# EAGLE design Andonstar LED Ring (EAGLE 6.2)
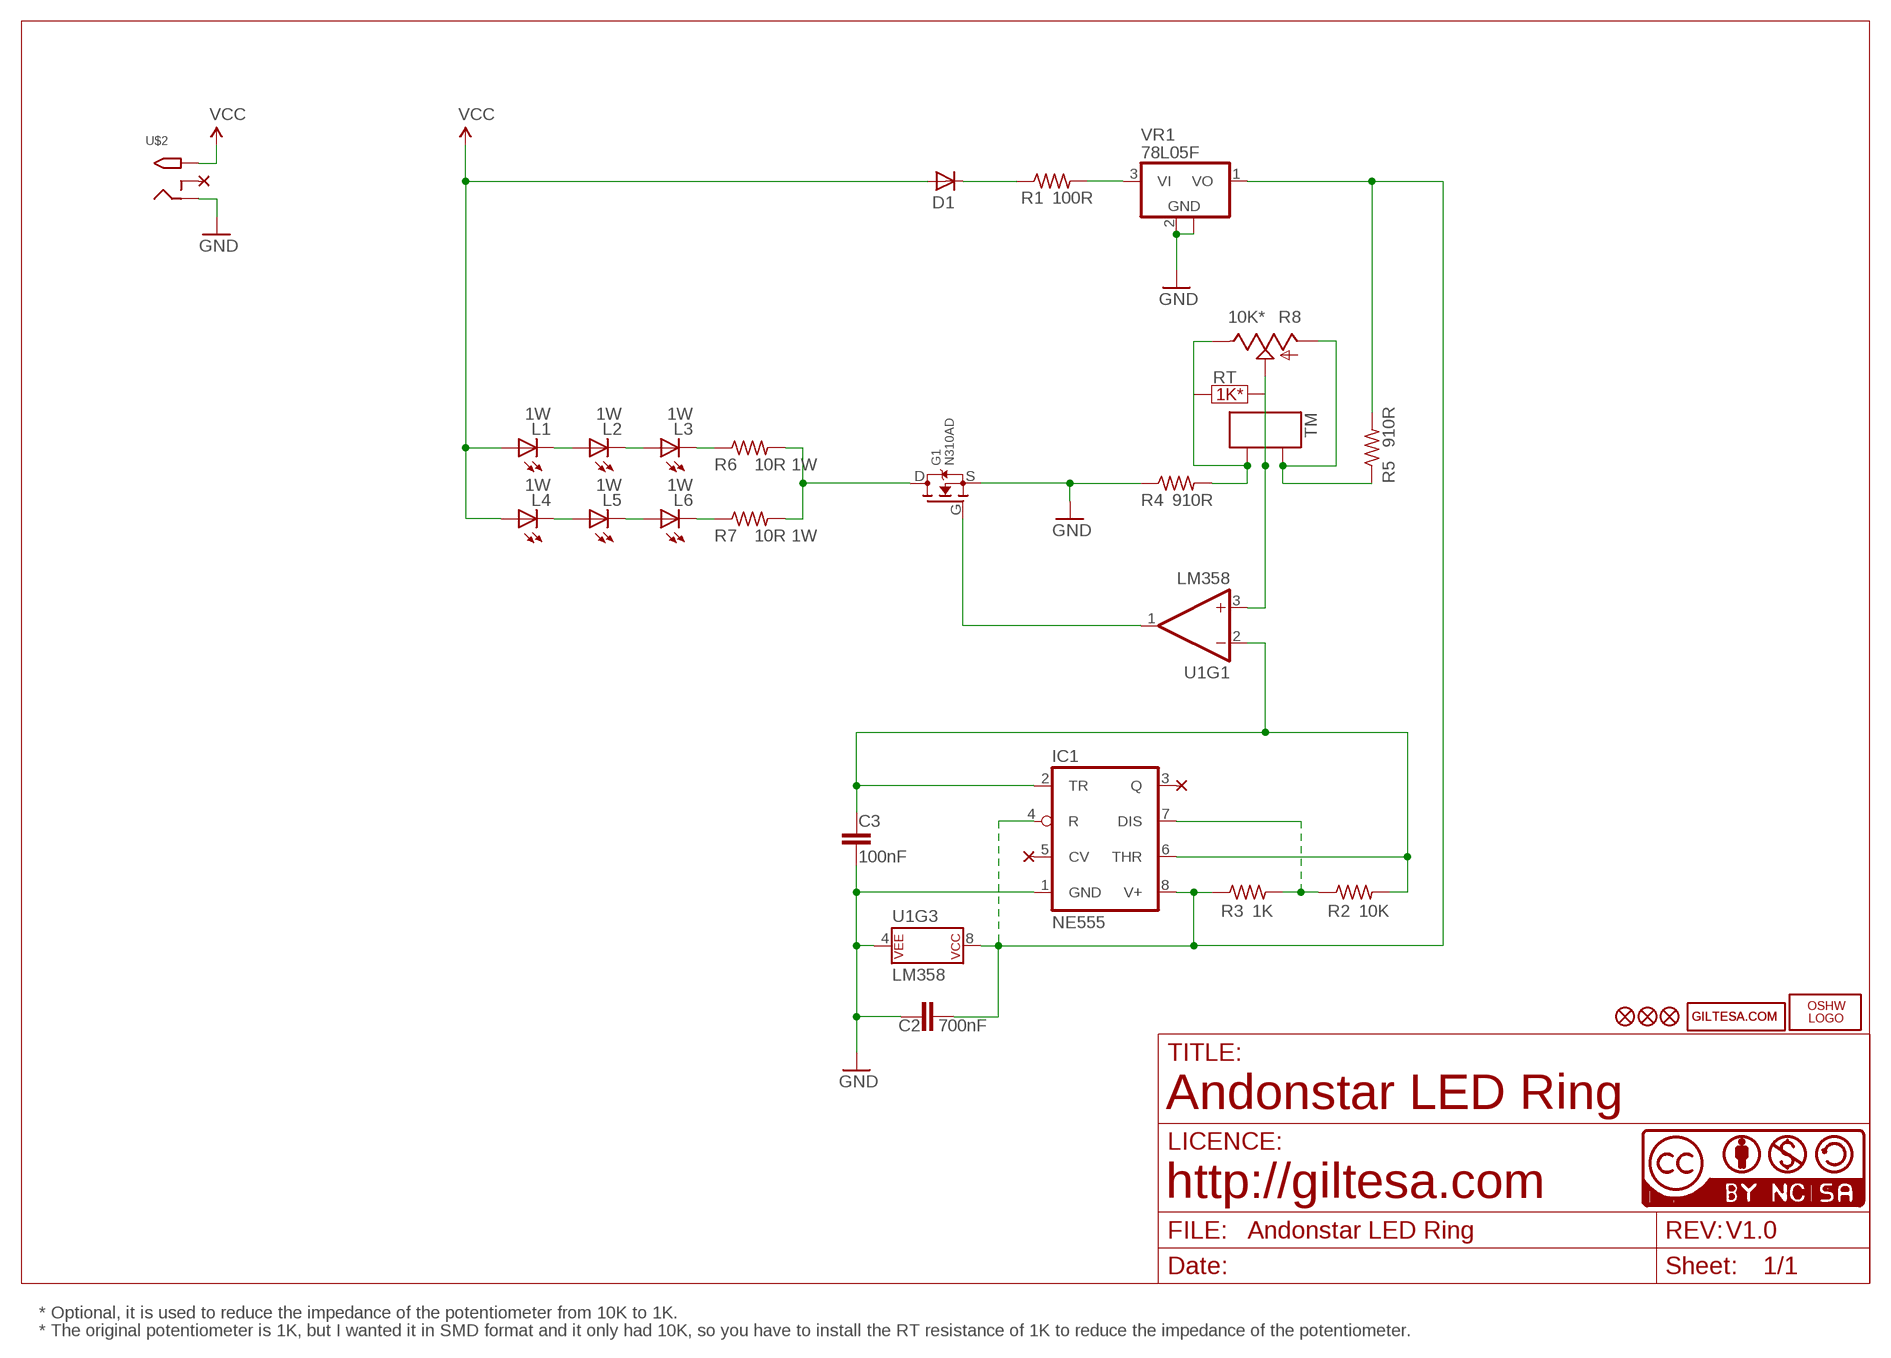
[diagram p0: schematic, sheet 1]

## Parts
C2  700nF  C0603  [C0603]
C3  100nF  C0603  [C0603]
D1  DIODE-GF1  [GF1]
G1  N310AD  FDD8447L  [TO-252]
IC1  NE555  NE555D  [SO08]
L1  1W  LED_Z_POWER  [LED_Z_POWER]
L2  1W  LED_Z_POWER  [LED_Z_POWER]
L3  1W  LED_Z_POWER  [LED_Z_POWER]
L4  1W  LED_Z_POWER  [LED_Z_POWER]
L5  1W  LED_Z_POWER  [LED_Z_POWER]
L6  1W  LED_Z_POWER  [LED_Z_POWER]
LOGO1  OSHW_LOGO_FILLX0150-NT  [OSHW_FILLX150_NOTEXT]
R1  100R  R1206  [R1206]
R2  10K  R0603  [R0603]
R3  1K  R0603  [R0603]
R4  910R  R0603  [R0603]
R5  910R  R0603  [R0603]
R6  10R 1W  R-US_R2512  [R2512]
R7  10R 1W  R-US_R2512  [R2512]
R8  10K*  TRIMPOT_16MM_SMD  [TRIMPOT_SMD_16MM]
TM  1X03  [1X03_SMD]
U1  LM358  [SO08]
U$1  GILTESA.COM_MASK  [GILTESA.COM_MASK]
U$2  2.1MMJACKSMT  [DCJACK_2MM_SMT]
U$6  FIDUCIAL1X2  [FIDUCIAL-1X2]
U$7  FIDUCIAL1X2  [FIDUCIAL-1X2]
U$8  GILTESA.COM_COPPER_STOP  [GILTESA.COM_COPPER_STOP]
U$14  FIDUCIAL1X2  [FIDUCIAL-1X2]
U$20  CC-NC-BCNIX  [CC-NC-B_NIX]
VR1  78L05F  [SOT89]

## Nets
GND: C2.2 C3.1 G1.S IC1.1(GND) R4.1 U1.4(P$V-) U$2.GND(RING) VR1.2(GND) VR1.2@1(GND)
N$1: L5.C L6.A
N$2: L4.C L5.A
N$3: L2.C L3.A
N$4: L1.C L2.A
N$5: L3.C R6.1
N$6: L6.C R7.1
N$8: IC1.7(DIS) R2.1 R3.2
N$9: G1.D R6.2 R7.2
N$10: C3.2 IC1.2(TR) IC1.6(THR) R2.2 U1.2(-IN)
N$18: R8.S TM.2 U1.3(+IN)
N$19: R5.1 R8.A TM.3
N$20: R4.2 R8.B TM.1
N$21: R1.2 VR1.3(VI)
N$23: C2.1 IC1.4(R) IC1.8(V+) R3.1 R5.2 U1.8(P$V+) VR1.1(VO)
N$24: D1.C R1.1
N$26: G1.G U1.1(OUT)
VCC: D1.A L1.A L4.A U$2.PWR2(TIP)
Unconnected: IC1.3(Q) IC1.5(CV) U1.5(+IN) U1.6(-IN) U1.7(OUT) U$2.GNDBREAK(RING_SW)

## Notes on the sheet
- RT
- 1K*
- Andonstar LED Ring
- http://giltesa.com
- V1.0
- * Optional, it is used to reduce the impedance of the potentiometer from 10K to 1K.
- * The original potentiometer is 1K, but I wanted it in SMD format and it only had 10K, so you have to install the RT resistance of 1K to reduce the impedance of the potentiometer.

## Library data of the parts
C2 C3 = ,giltesa:C0603
D1 = diode:DIODE-: DIODE
G1 = ,giltesa:FDD8447L
IC1 = adafruit:*555: TIMER Changed DIP package to have round (not oval) pin pads http://www.ladyada.net/library/pcb/eaglelibrary.html
L1-L6 = ,giltesa:LED_Z_POWER
LOGO1 = ohw-logo:OSHW_LOGO_FILL
R1 = ,giltesa:R1206
R2-R5 = ,giltesa:R0603
R6 R7 = adafruit:R-US_: RESISTOR, American symbol
R8 = ,giltesa:TRIMPOT_16MM
TM = ,giltesa:1X03
U1 = SparkFun-IC-Amplifiers:LM358: LM358 Jellybean op-amp Datasheet <http://www.sparkfun.com/datasheets/Components/General/LM358.pdf> SparkFun Products Op-Amp (Thru-Hole) - LM358 <https://www.sparkfun.com/products/9456> (COM-09456)
U$1 U$8 = ,giltesa_logos:GILTESA.COM
U$2 = adafruit:2.1MMJACK: 2.1mm x 5.5mm THM DC jack with internal switch. Digikey part #PJ-102A, 4UCON part #05537 2.1mm x 5.5mm SMT DC jack with internal switch. Digikey part #PJ-002A-SMT, 4UCON part #03267 By microbuilder.eu & adafruit.com
U$6 U$7 U$14 = SparkFun:FIDUCIAL: Fiducial Alignment Points Various fiducial points for machine vision alignment.
U$20 = cc-by-nc-sa:CC-NC-BC: All hardware is licensed under the Creative Commons Attribution-Noncommercial-Share Alike 2.5 Switzerland License. To view a copy of this license, visit http://creativecommons.org/licenses/by-nc-sa/2.5/ch/ or send a letter to Creative Commons, 171 Second Street, Suite 300, San Francisco, California, 94105, USA.
VR1 = linear:78L*: POSITOIV-VOLTAGE REGULATORS Output up to 100 mA Source: http://focus.ti.com/lit/ds/symlink/ua78l05.pdf

## Board
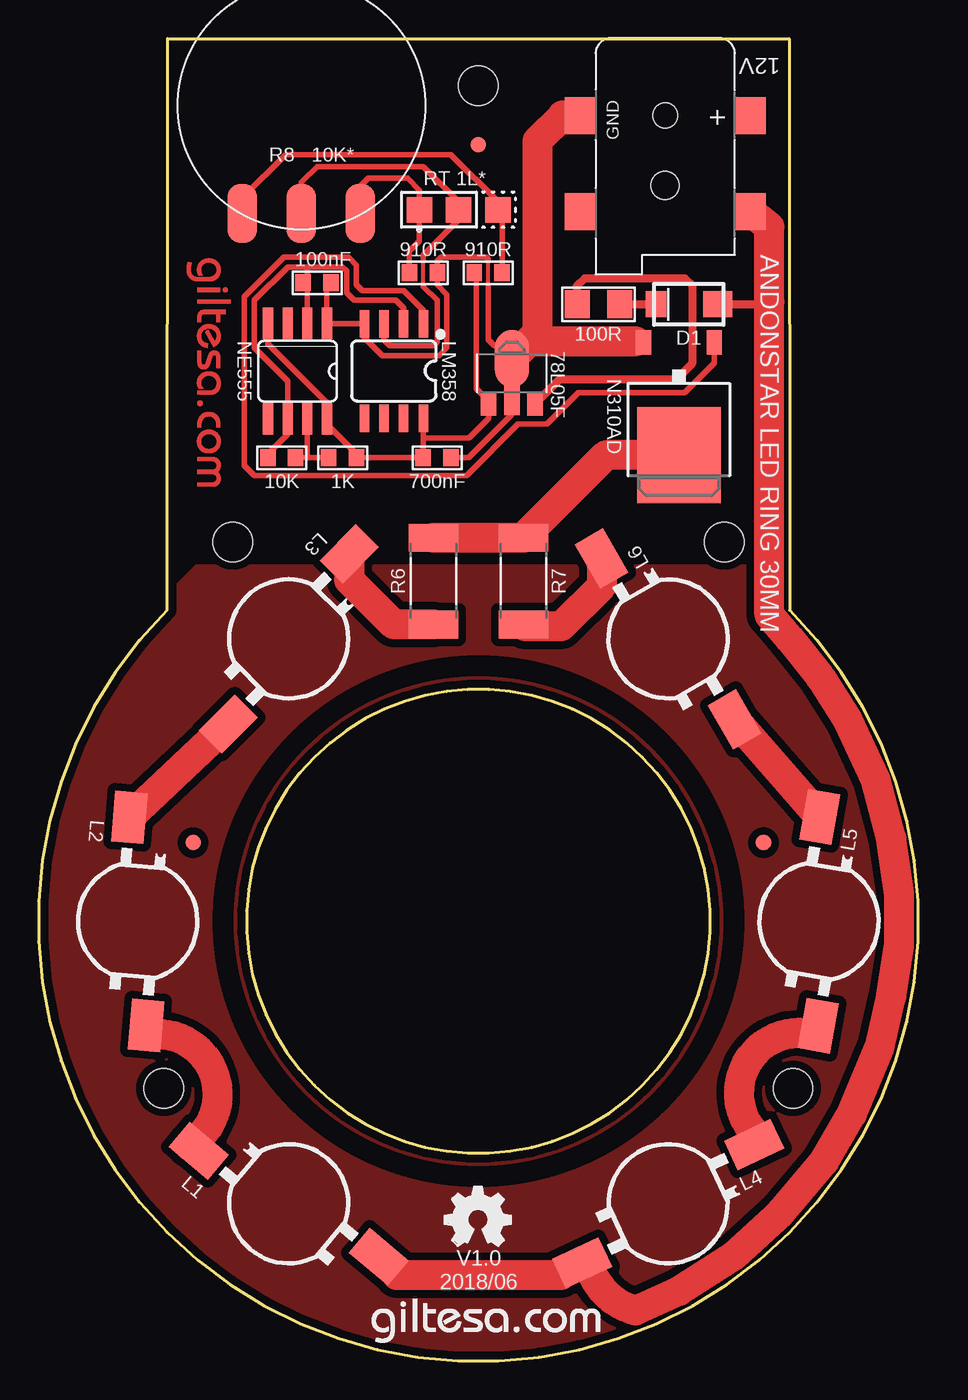
[diagram p1: board, top side]

Size 56.79 x 85.42 mm. Coordinates in mm from the lower left corner, seen from the top.
Outline: 17.8,38.99 arc90 17.8,17.8 arc90 38.99,17.8 arc90 38.99,38.99 arc90 17.8,38.99
Outline: 8.3,48.5 arc90 8.3,8.3 arc90 48.5,8.3 arc90 48.5,48.5 48.46,85.42 8.33,85.42 8.3,48.5
Copper layers (1*16): Top 0.035mm / dielectric 1.6mm / Bottom 0.035mm
Design rules: minimum track width 6mil, minimum drill 12mil, track to track 6mil, track to pad 6mil, pad to pad 6mil, via to via 8mil, smd to smd 0mil, copper to edge 20mil, drill to drill 10mil, minimum pad ring 6mil, minimum via ring 6mil, stop-mask expansion 0mil, vias tented up to drill 100mil, thermal gap 10mil
Holes 2.54 mm at 48.72,17.6 8.08,17.6 44.27,52.89 12.52,52.89 28.4,82.37
tRestrict: area 11.9,11.9 to 44.9,44.9; area 13.7,13.7 to 43.1,43.1

### Footprints (pad centres in the part's own frame; a part is rotated, then mirrored left to right if it is on the bottom)
C0603 = smd 1 x 1.1: 1 -0.901,0; 2 0.901,0
GF1 = smd 1.85 x 1.68: A 1.87,0 | smd 1.32 x 1.68: C -2.12,0
TO-252 = smd 5.4 x 6.2: D 0,2.5 | smd 1 x 1.6: G -2.28,-4.8; S 2.28,-4.8
SO08 = smd 0.66 x 2.032: 1 -1.905,-3.073; 2 -0.635,-3.073; 3 0.635,-3.073; 4 1.905,-3.073; 5 1.905,3.073; 6 0.635,3.073; 7 -0.635,3.073; 8 -1.905,3.073
LED_Z_POWER = smd 3.3 x 2.1: A -6.65,-1.12; C 6.65,1.12
R1206 = smd 1.6 x 1.8: 1 -1.387,0; 2 1.362,0
R0603 = smd 1 x 1.1: 1 -0.901,0; 2 0.901,0
R2512 = smd 1.8 x 3.2: 1 -2.8,0; 2 2.8,0
TRIMPOT_SMD_16MM = smd 1.905 x 3.81: A -3.81,-6.985; B 3.81,-6.985; S 0,-6.985
1X03_SMD = smd 1.651 x 1.651: 1 0,-2.54; 2 0,0; 3 0,2.54
SO08' = smd 0.61 x 1.778: 1 -1.905,-3.054; 2 -0.635,-3.054; 3 0.635,-3.054; 4 1.905,-3.054; 5 1.905,3.054; 6 0.635,3.054; 7 -0.635,3.054; 8 -1.905,3.054
DCJACK_2MM_SMT = smd 2.4 x 2: GND 0,-5.5; GNDBREAK 6.2,-5.5; PWR1 0,5.5; PWR2 6.2,5.5 | hole 1.6: 0,0 | hole 1.8: 4.5,0
FIDUCIAL-1X2 = smd 1 x 1: 1 0,0
SOT89 = smd 1 x 1.5: 1 -1.499,-1.981; 3 1.499,-1.981 | smd 1 x 2: 2 0,-1.727 | smd 2.2 x 3.7: 2@1 0,0.94

### Placement (x,y rotation side)
C2  25.73,58.35 0 top
C3  17.98,69.65 180 top
D1  41.98,68.26 0 top
G1  41.35,61 180 top
IC1  16.71,63.94 180 top
L1  16.15,10.15 140 top
L2  6.4,28.4 85 top
L3  16.15,46.65 45 top
L4  40.65,10.15 25 top
L5  50.4,28.4 80 top
L6  40.65,46.65 120 top
LOGO1  26.24,7.44 0 top
R1  36.14,68.26 180 top
R2  15.7,58.35 180 top
R3  19.63,58.35 180 top
R4  24.84,70.29 180 top
R5  29.03,70.29 180 top
R6  25.49,50.38 90 top
R7  31.3,50.38 90 top
R8  16.97,81.1 0 top
TM  27.13,74.35 270 top
U1  LM358  [SO08']  22.93,63.94 180 top
U$1  21.41,1.09 0 top
U$2  40.46,80.45 270 top
U$6  28.4,78.56 0 top
U$7  9.98,33.48 0 top
U$8  9.47,71.32 270 top
U$14  46.81,33.48 0 top
U$20  28.4,28.4 0 top
VR1  30.55,63.81 0 top

### Tracks (layer width: path | path; a pad name or v marks a point on that pad's centre or on a via)
GND
  Top 0.254: 29.03,69.4 29.03,71.18
  Top 0.356: C3.1 18.62,69.39 IC1.1 18.64,66.99 U1.4 21.03,66.1 22.17,64.96 25.86,64.96 26.36,65.46 26.36,68.89 25.73,69.53 R4.1 25.73,70.3 25.73,71.05 25.98,71.31 28.9,71.31 29.03,71.18 | C2.2 27.76,58.35 30.55,61.15 VR1.2 VR1.2@1 30.38,64.75 29.67,65.46 29.41,65.59 29.03,65.97 29.03,69.4
  Top 0.508: G1.S 38.61,65.8 38.56,65.86
  Top 1.93: 38.56,65.86 31.66,65.86 VR1.2@1 32.21,66.4 32.21,78.81 33.84,80.45 U$2.GND
N$1
  Top 1.93: L5.C L6.A
N$2
  Top 1.93: L4.C 46.81,14.17 arc-160 50.24,21.03 L5.A
N$3
  Top 1.93: L2.C L3.A
N$4
  Top 1.93: L2.A 6.93,21.28 6.81,21.03 arc-160 9.73,13.92 L1.C
N$5
  Top 1.93: L3.C 20.06,50.45 22.93,47.58 R6.1
N$6
  Top 1.778: 31.43,47.45 R7.1
  Top 1.93: L6.C 36.35,50.07 33.73,47.45 31.43,47.45
N$7
  pour Top (isolate 0.508): 10.19,51.38 46.61,51.38 arc-90 48.61,8.19 arc-90 8.19,8.19 arc-90
N$8
  Top 0.356: R2.1 17.35,58.35 | 17.35,58.35 R3.2 | IC1.7 17.35,58.35
N$9
  Top 1.93: G1.D 36.63,58.5 R7.2 R6.2
N$10
  Top 0.356: R2.2 14.79,58.59 16.08,59.88 IC1.6 16.08,63.3 13.92,65.46 13.92,68.51 16.08,70.67 17.35,70.67 | U1.2 23.57,68 23.06,68.51 20.39,68.51 19.89,69.02 19.89,70.42 19.63,70.67 17.35,70.67 | C3.2 17.09,69.67 17.22,69.67 17.35,69.8 | IC1.2 17.35,69.8 | 17.35,69.8 17.35,70.67
N$18
  Top 0.254: 24.84,69.4 24.84,71.18
  Top 0.356: U1.3 22.3,65.97 22.68,65.59 25.47,65.59 25.73,65.84 25.73,68.51 24.84,69.4 | R8.S 16.97,76.15 17.98,77.16 24.84,77.16 27.13,74.88 TM.2 27.13,73.73 24.84,71.45 24.84,71.18
N$19
  Top 0.356: R8.A 13.16,75.13 15.95,77.93 26.62,77.93 29.67,74.88 TM.3 29.93,74.09 R5.1
N$20
  Top 0.356: R8.B 20.78,75.89 21.28,76.4 23.82,76.4 24.59,75.64 TM.1 24.59,72.34 23.94,71.69 R4.2
N$21
  Top 0.508: VR1.3 33.61,63.39 41.17,63.39 42.24,64.46 42.24,69.42 41.73,69.92 35.25,69.92 34.75,69.42 34.75,68.29 R1.2
N$23
  Top 0.356: IC1.4 14.81,65.72 18.62,61.91 IC1.8 18.62,60.51 20.53,58.59 R3.1 C2.1 24.84,58.36 24.84,59.62 | U1.8 24.84,59.62 | 24.84,59.62 27.76,59.62 29.06,60.92 VR1.1 29.06,62.01 28.27,62.8 28.27,70.15 R5.2
N$24
  Top 0.508: R1.1 D1.C
N$26
  Top 0.356: U1.1 24.84,67.88 23.57,69.15 20.9,69.15 20.52,69.53 20.52,70.8 20.01,71.31 15.82,71.31 13.28,68.77 13.28,57.84 13.92,57.21 27.63,57.21 30.94,60.51 32.82,60.51 34.86,62.54 41.71,62.54 43.63,64.46 G1.G 43.64,64.8 43.64,64.46
VCC
  Top 0.508: D1.A 46.94,68.26
  Top 1.016: 46.94,68.26 47.19,68.4
  Top 1.778: 33.73,5.54 L4.A 35.48,6.32 | 23.15,5.54 L1.A
  Top 1.93: 33.73,5.54 23.15,5.54 | 35.48,6.32 arc60 38.56,3.25 41.35,4.52 44.91,6.81 47.95,9.6 50.75,12.9 52.53,15.95 54.3,20.27 55.07,23.57 55.57,26.87 55.57,30.17 55.07,33.73 54.05,37.54 52.27,41.35 50.49,44.14 48.46,46.68 47.19,48.21 47.19,68.4 47.19,73.27 U$2.PWR2

### Text on the board
tPlace: 12V | RT 1L* | ANDONSTAR LED RING 30MM | V1.0 | 2018/06